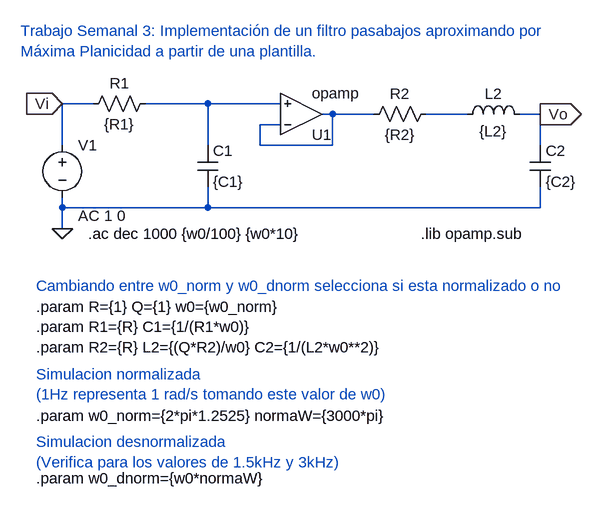
[diagram p0: schematic butter_lp_bobinas.asc]
butter_lp_bobinas.asc, the LTspice schematic file:
Version 4
SHEET 1 1140 696
WIRE 96 96 48 96
WIRE 272 96 176 96
WIRE 384 96 272 96
WIRE 464 112 448 112
WIRE 528 112 464 112
WIRE 672 112 608 112
WIRE 784 112 752 112
WIRE 384 128 352 128
WIRE 48 160 48 96
WIRE 272 160 272 96
WIRE 352 160 352 128
WIRE 464 160 464 112
WIRE 464 160 352 160
WIRE 784 160 784 112
WIRE 48 256 48 240
WIRE 272 256 272 224
WIRE 272 256 48 256
WIRE 784 256 784 224
WIRE 784 256 272 256
WIRE 48 288 48 256
FLAG 48 288 0
FLAG 48 96 Vi
IOPIN 48 96 In
FLAG 784 112 Vo
IOPIN 784 112 Out
SYMBOL res 192 80 R90
WINDOW 0 0 56 VBottom 2
WINDOW 3 32 56 VTop 2
SYMATTR InstName R1
SYMATTR Value {R1}
SYMBOL cap 256 160 R0
SYMATTR InstName C1
SYMATTR Value {C1}
SYMBOL voltage 48 144 R0
WINDOW 123 24 124 Left 2
WINDOW 39 0 0 Left 0
SYMATTR Value2 AC 1 0
SYMATTR InstName V1
SYMATTR Value ""
SYMBOL res 624 96 R90
WINDOW 0 0 56 VBottom 2
WINDOW 3 32 56 VTop 2
SYMATTR InstName R2
SYMATTR Value {R2}
SYMBOL ind 656 128 R270
WINDOW 0 32 56 VTop 2
WINDOW 3 5 56 VBottom 2
SYMATTR InstName L2
SYMATTR Value {L2}
SYMBOL cap 768 160 R0
SYMATTR InstName C2
SYMATTR Value {C2}
SYMBOL OpAmps\\opamp 416 176 M180
SYMATTR InstName U1
TEXT 88 296 Left 2 !.ac dec 1000 {w0/100} {w0*10}
TEXT 8 408 Left 2 !.param R={1} Q={1} w0={w0_norm}\n.param R1={R} C1={1/(R1*w0)}\n.param R2={R} L2={(Q*R2)/w0} C2={1/(L2*w0**2)}
TEXT 600 296 Left 2 !.lib opamp.sub
TEXT 8 576 Left 2 !.param w0_norm={2*pi*1.2525} normaW={3000*pi}
TEXT 8 512 Left 2 ;Simulacion normalizada\n(1Hz representa 1 rad/s tomando este valor de w0)
TEXT 8 616 Left 2 ;Simulacion desnormalizada\n(Verifica para los valores de 1.5kHz y 3kHz)
TEXT 8 672 Left 2 !.param w0_dnorm={w0*normaW}
TEXT -16 -16 Left 2 ;Trabajo Semanal 3: Implementación de un filtro pasabajos aproximando por\nMáxima Planicidad a partir de una plantilla.
TEXT 8 376 Left 2 ;Cambiando entre w0_norm y w0_dnorm selecciona si esta normalizado o no

The netlist it stands for:
* butter_lp_bobinas.asc
R1 N001 Vi {R1}
C1 N001 0 {C1}
V1 Vi 0 AC 1 0
R2 N003 N002 {R2}
L2 N003 Vo {L2}
C2 Vo 0 {C2}
XU1 N002 N001 N002 opamp Aol=100K GBW=10Meg  ; pins invin noninvin out
.ac dec 1000 {w0/100} {w0*10}
.param R={1} Q={1} w0={w0_norm}
.param R1={R} C1={1/(R1*w0)}
.param R2={R} L2={(Q*R2)/w0} C2={1/(L2*w0**2)}
.lib opamp.sub
.param w0_norm={2*pi*1.2525} normaW={3000*pi}
* Simulacion normalizada
* (1Hz representa 1 rad/s tomando este valor de w0)
* Simulacion desnormalizada
* (Verifica para los valores de 1.5kHz y 3kHz)
.param w0_dnorm={w0*normaW}
* Trabajo Semanal 3: Implementación de un filtro pasabajos aproximando por
* Máxima Planicidad a partir de una plantilla.
* Cambiando entre w0_norm y w0_dnorm selecciona si esta normalizado o no
.backanno
.end